# EAGLE schematic Motor-Driver (EAGLE 9.3.2)
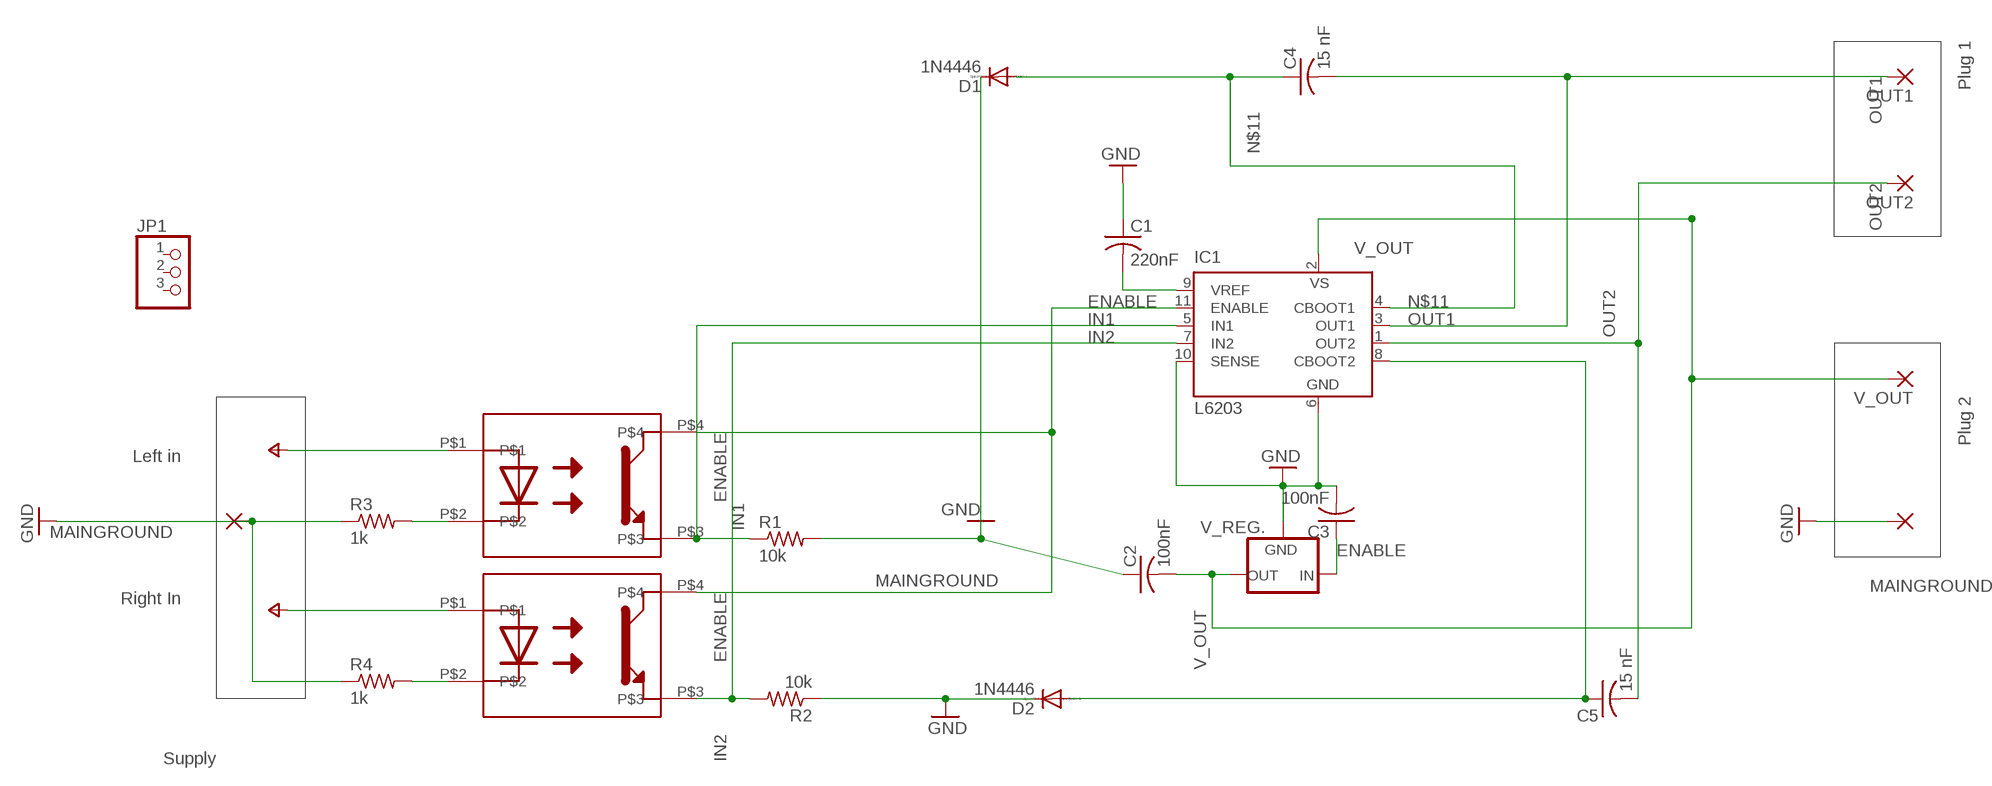
[diagram p0: schematic, sheet 1]

## Parts
C1  220nF  C-US075-032X103  [C075-032X103]
C2  100nF  C-US075-032X103  [C075-032X103]
C3  100nF  C-US075-032X103  [C075-032X103]
C4  15 nF  C-US075-032X103  [C075-032X103]
C5  15 nF  C-US075-032X103  [C075-032X103]
D1  1N4446  [DO35-10]
D2  1N4446  [DO35-10]
IC1  L6203  [MULTIWATT-11]
JP1  PINHD-1X3  [1X03]
MAINGROUND  PAD-TERMINAL  [2,54/1,1]
OUT1  PAD-TERMINAL  [2,54/1,1]
OUT2  PAD-TERMINAL  [2,54/1,1]
OUT_GND  PAD-TERMINAL  [2,54/1,1]
R1  10k  R-US_0204/7  [0204/7]
R2  10k  R-US_0204/7  [0204/7]
R3  1k  R-US_0204/7  [0204/7]
R4  1k  R-US_0204/7  [0204/7]
U$1  TPL521  [TPL521]
U$2  TPL521  [TPL521]
V_OUT  PAD-TERMINAL  [2,54/1,1]
V_REG.  V_REG_78XXTO-92_UNTESTED  [TO-92]

## Nets
ENABLE: C3.1 IC1.11(ENABLE) U$1.P$4 U$2.P$4 V_REG..3(IN)
IN1: IC1.5(IN1) R1.1 U$1.P$3
IN2: IC1.7(IN2) R2.2 U$2.P$3
MAINGROUND: C1.1 C2.1 C3.2 D1.C D2.C IC1.6(GND) IC1.10(SENSE) MAINGROUND.1(P) OUT_GND.1(P) R1.2 R2.1 R3.1 R4.1 V_REG..2(GND) ; supply symbol labelled GND
N$2: R3.2 U$1.P$2
N$3: R4.2 U$2.P$2
N$8: C1.2 IC1.9(VREF)
N$9: C5.1 D2.A IC1.8(CBOOT2)
N$11: C4.1 D1.A IC1.4(CBOOT1)
OUT1: C4.2 IC1.3(OUT1) OUT1.1(P)
OUT2: C5.2 IC1.1(OUT2) OUT2.1(P)
V+: U$1.P$1 ; supply symbol labelled Left in
V-: U$2.P$1 ; supply symbol labelled Right In
V_OUT: C2.2 IC1.2(VS) V_OUT.1(P) V_REG..1(OUT)
Unconnected: JP1.1 JP1.2 JP1.3

## Notes on the sheet
- Plug 1
- Plug 2
- Supply

## Library data of the parts
C1-C5 = rcl:C-US: CAPACITOR, American symbol; SPICEPREFIX: C
D1 D2 = diode:1N4446: DIODE high speed (Philips)
IC1 = RoboSoccer:L6203: DMOS FULL BRIDGE DRIVER; MPN: L6203; OC_FARNELL: 1467715; OC_NEWARK: 56P8434
JP1 = pinhead:PINHD-1X3: PIN HEADER
MAINGROUND OUT1 OUT2 OUT_GND V_OUT = ee2parts.rpt:PAD-TERMINAL: LARGE THROUGH-HOLE PAD Large pad for mounting PCB pin for convenient prototype off-board connections
R1-R4 = rcl:R-US_: RESISTOR, American symbol; SPICEPREFIX: R
U$1 U$2 = RoboSoccer:TPL521
V_REG. = SparkFun-IC-Power:V_REG_78XX: Voltage Regulator Standard 78xx regulator. IGO (Input Ground Output). Spark Fun Electronics SKU : COM-00107